# Altium project QCopterFC.PrjPCB
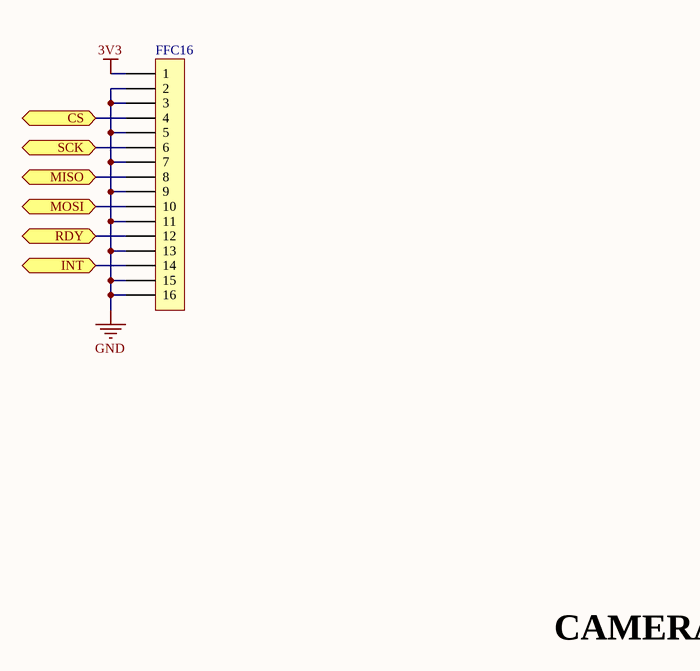
[diagram p0: QCopterFC_CAM_Sch.SchDoc]
6 sheets, 35 parts. Net scope: hierarchical (ports join the sheet entries above them; power ports are global).
Board file: QCopterFC__Pcb.PcbDoc
Sheets:
  QCopterFC_CAM_Sch.SchDoc
  QCopterFC_IMU_Sch.SchDoc
  QCopterFC_KEY_Sch.SchDoc
  QCopterFC_LED_Sch.SchDoc
  QCopterFC_MAIN_Sch.SchDoc
  QCopterFC_MCU_Sch.SchDoc

## Sheet QCopterFC_CAM_Sch.SchDoc
size A4

### Parts
FFC16  FFC_0.5_16  [FFC_0.5_16]  (value not drawn)

### Ports
CS, INT, MISO, MOSI, RDY, SCK

### Nets
3V3: FFC16.1
GND: FFC16.2 FFC16.3 FFC16.5 FFC16.7 FFC16.9 FFC16.11 FFC16.13 FFC16.15 FFC16.16
NetFFC16_4: FFC16.4 ; port CS
NetFFC16_6: FFC16.6 ; port SCK
NetFFC16_8: FFC16.8 ; port MISO
NetFFC16_10: FFC16.10 ; port MOSI
NetFFC16_12: FFC16.12 ; port RDY
NetFFC16_14: FFC16.14 ; port INT

### Notes on the sheet
- CAMERA

### Library data of the parts
FFC16 = FFC_0.5_16: FFC

## Sheet QCopterFC_IMU_Sch.SchDoc
size A4
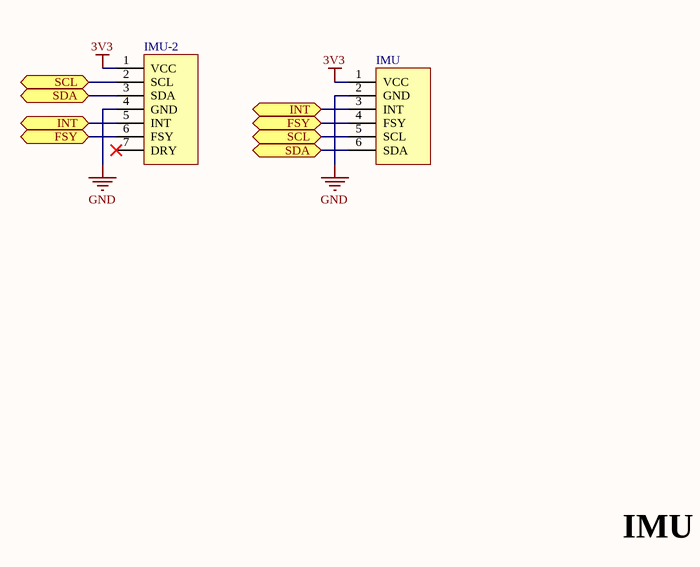
[diagram p1: QCopterFC_IMU_Sch.SchDoc]

### Parts
IMU  IMU  [IMU]
IMU-2  IMU-2  [IMU-2]  (value not drawn)

### Ports
FSY, INT, SCL, SDA

### Nets
3V3: IMU.1(VCC) IMU-2.1(VCC)
GND: IMU.2(GND) IMU-2.4(GND)
NetIMU_3: IMU.3(INT) IMU-2.5(INT) ; port INT
NetIMU_4: IMU.4(FSY) IMU-2.6(FSY) ; port FSY
NetIMU_5: IMU.5(SCL) IMU-2.2(SCL) ; port SCL
NetIMU_6: IMU.6(SDA) IMU-2.3(SDA) ; port SDA

Not connected (* = marked no-connect by the designer): IMU-2 7(DRY)*

### Notes on the sheet
- IMU

### Library data of the parts
IMU = IMU: Module
IMU-2 = IMU-2: Module

## Sheet QCopterFC_KEY_Sch.SchDoc
size A4
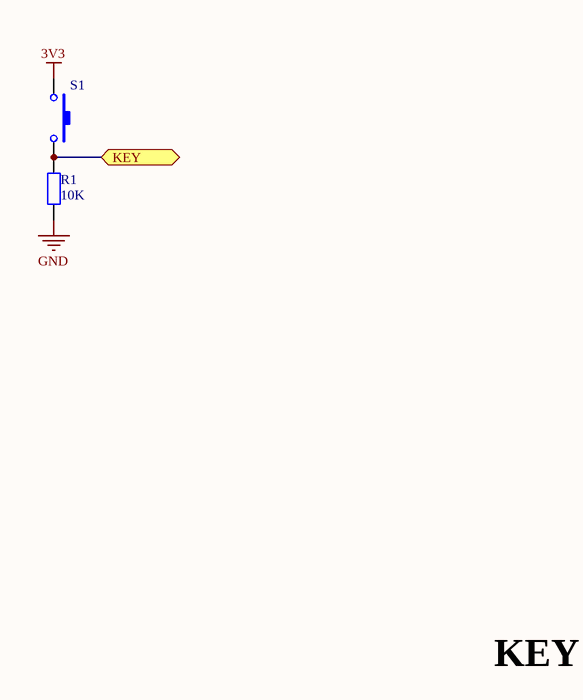
[diagram p2: QCopterFC_KEY_Sch.SchDoc]

### Parts
R1  value 10K  [RES_0603]  (hidden comment: Res_0603)
S1  SW-PB_1  [BT_90_T]  (value not drawn)

### Ports
KEY

### Nets
3V3: S1.1
GND: R1.1
NetR1_2: R1.2 S1.2 ; port KEY

### Notes on the sheet
- KEY

### Library data of the parts
R1 = Res_0603: Resistor
S1 = SW-PB_1: Switch; Published: 24-Mar-1999; LatestRevisionDate: 17-Jul-2002; LatestRevisionNote: Re-released for DXP Platform.; PackageReference: SPST-2; Publisher: Altium Limited; PackageDescription: Switch; 2 Leads

## Sheet QCopterFC_LED_Sch.SchDoc
size A4
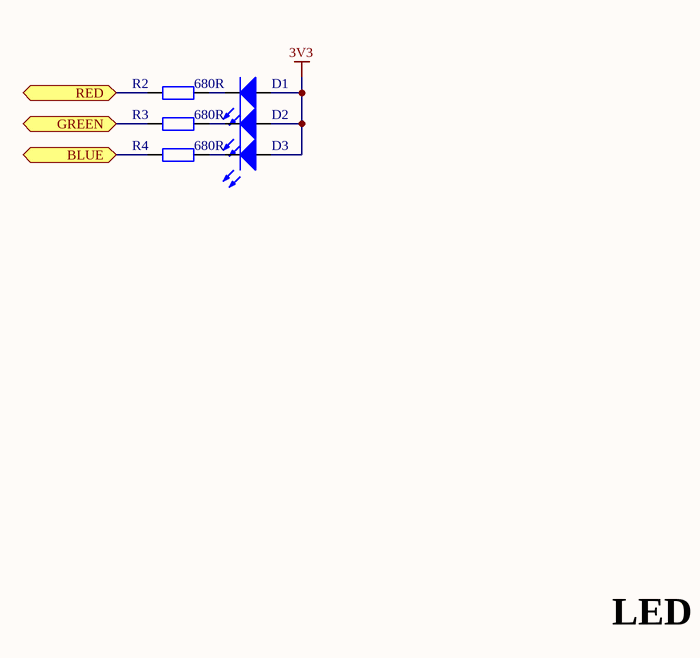
[diagram p3: QCopterFC_LED_Sch.SchDoc]

### Parts
D1  LED_0603_RED  [LED_0603_RED]  (value not drawn)
D2  LED_0603_GREEN  [LED_0603_GREEN]  (value not drawn)
D3  LED_0603_BLUE  [LED_0603_BLUE]  (value not drawn)
R2  value 680R  [RES_0603]  (hidden comment: Res_0603)
R3  value 680R  [RES_0603]  (hidden comment: Res_0603)
R4  value 680R  [RES_0603]  (hidden comment: Res_0603)

### Ports
BLUE, GREEN, RED

### Nets
3V3: D1.1(A) D2.1(A) D3.1(A)
NetD1_2: D1.2(K) R2.2
NetD2_2: D2.2(K) R3.2
NetD3_2: D3.2(K) R4.2
NetR2_1: R2.1 ; port RED
NetR3_1: R3.1 ; port GREEN
NetR4_1: R4.1 ; port BLUE

### Notes on the sheet
- LED

### Library data of the parts
D1 = LED_0603_RED: LED
D2 = LED_0603_GREEN: LED
D3 = LED_0603_BLUE: LED
R2-R4 = Res_0603: Resistor

## Sheet QCopterFC_MAIN_Sch.SchDoc
size A4
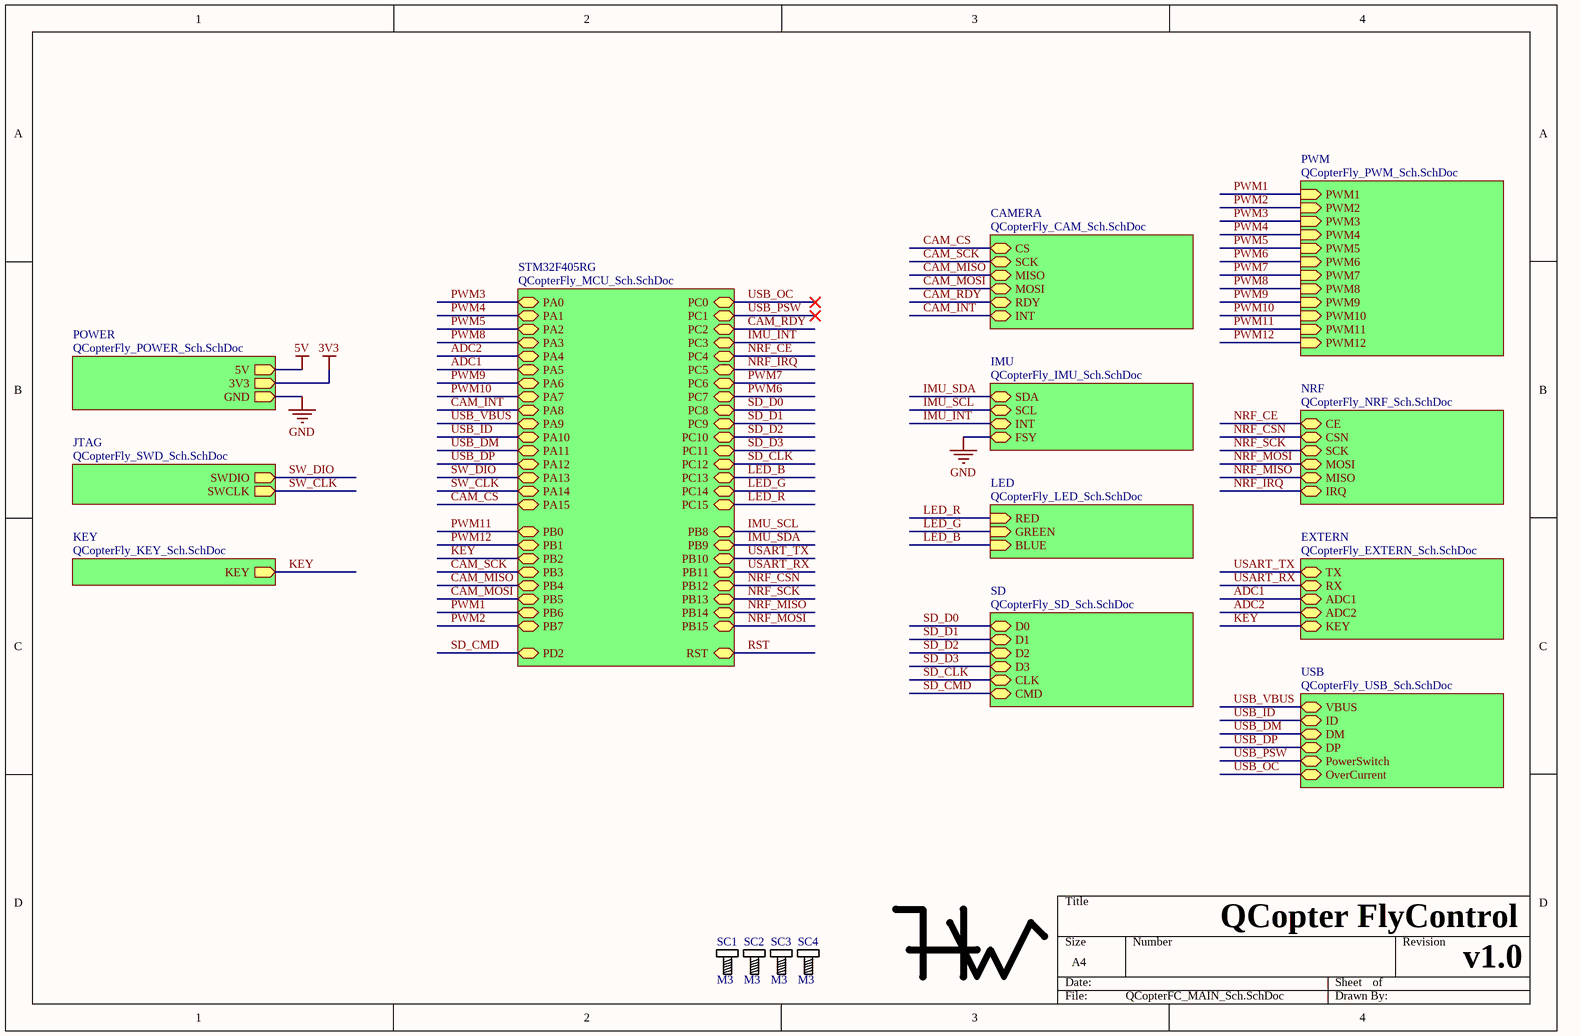
[diagram p4: QCopterFC_MAIN_Sch.SchDoc]

### Parts
Mark1  Mark  [HW_Mark]  (value not drawn)
SC1  M3  [SCRREW_M3]
SC2  M3  [SCRREW_M3]
SC3  M3  [SCRREW_M3]
SC4  M3  [SCRREW_M3]

### Sub-sheets
CAMERA = QCopterFly_CAM_Sch.SchDoc (file not in this document): MISO, CS, MOSI, SCK, RDY, INT
EXTERN = QCopterFly_EXTERN_Sch.SchDoc (file not in this document): ADC1, ADC2, TX, RX, KEY
IMU = QCopterFly_IMU_Sch.SchDoc (file not in this document): SCL, SDA, FSY, INT
JTAG = QCopterFly_SWD_Sch.SchDoc (file not in this document): SWDIO (out), SWCLK (out)
KEY = QCopterFly_KEY_Sch.SchDoc (file not in this document): KEY (out)
LED = QCopterFly_LED_Sch.SchDoc (file not in this document): RED (in), GREEN (in), BLUE (in)
NRF = QCopterFly_NRF_Sch.SchDoc (file not in this document): MISO, MOSI, SCK, CSN, CE, IRQ
POWER = QCopterFly_POWER_Sch.SchDoc (file not in this document): 3V3 (out), 5V (out), GND (out)
PWM = QCopterFly_PWM_Sch.SchDoc (file not in this document): PWM1 (in), PWM2 (in), PWM3 (in), PWM4 (in), PWM5 (in), PWM6 (in), PWM7 (in), PWM8 (in), PWM9 (in), PWM10 (in), PWM11 (in), PWM12 (in)
SD = QCopterFly_SD_Sch.SchDoc (file not in this document): D0, CLK, CMD, D1, D2, D3
STM32F405RG = QCopterFly_MCU_Sch.SchDoc (file not in this document): PA0, PA1, PA2, PA3, PA4, PA5, PA6, PA7, PA8, PA9, PA10, PA11, PA12, PA13, PA14, PA15, PB0, PB1, PB2, PB3, PB4, PB5, PB6, PB7, PB8, PB9, PB10, PB11, PB12, PB13, PB14, PB15, PC0, PC1, PC2, PC3, PC4, PC5, PC6, PC7, PC8, PC9, PC10, PC11, PC12, PC13, PC14, PC15, PD2, RST
USB = QCopterFly_USB_Sch.SchDoc (file not in this document): VBUS, ID, DM, DP, PowerSwitch, OverCurrent

### Nets
5V: sheet POWER/5V
GND: sheet IMU/FSY, sheet POWER/GND
ADC1: sheet STM32F405RG/PA5, sheet EXTERN/ADC1
ADC2: sheet STM32F405RG/PA4, sheet EXTERN/ADC2
CAM_CS: sheet CAMERA/CS, sheet STM32F405RG/PA15
CAM_INT: sheet CAMERA/INT, sheet STM32F405RG/PA8
CAM_MISO: sheet CAMERA/MISO, sheet STM32F405RG/PB4
CAM_MOSI: sheet CAMERA/MOSI, sheet STM32F405RG/PB5
CAM_RDY: sheet CAMERA/RDY, sheet STM32F405RG/PC2
CAM_SCK: sheet CAMERA/SCK, sheet STM32F405RG/PB3
IMU_INT: sheet IMU/INT, sheet STM32F405RG/PC3
IMU_SCL: sheet IMU/SCL, sheet STM32F405RG/PB8
IMU_SDA: sheet IMU/SDA, sheet STM32F405RG/PB9
KEY: sheet KEY/KEY, sheet STM32F405RG/PB2, sheet EXTERN/KEY
LED_B: sheet LED/BLUE, sheet STM32F405RG/PC13
LED_G: sheet LED/GREEN, sheet STM32F405RG/PC14
LED_R: sheet LED/RED, sheet STM32F405RG/PC15
NRF_CE: sheet NRF/CE, sheet STM32F405RG/PC4
NRF_CSN: sheet NRF/CSN, sheet STM32F405RG/PB12
NRF_IRQ: sheet NRF/IRQ, sheet STM32F405RG/PC5
NRF_MISO: sheet NRF/MISO, sheet STM32F405RG/PB14
NRF_MOSI: sheet NRF/MOSI, sheet STM32F405RG/PB15
NRF_SCK: sheet NRF/SCK, sheet STM32F405RG/PB13
PWM1: sheet PWM/PWM1, sheet STM32F405RG/PB6
PWM2: sheet PWM/PWM2, sheet STM32F405RG/PB7
PWM3: sheet PWM/PWM3, sheet STM32F405RG/PA0
PWM4: sheet PWM/PWM4, sheet STM32F405RG/PA1
PWM5: sheet PWM/PWM5, sheet STM32F405RG/PA2
PWM6: sheet PWM/PWM6, sheet STM32F405RG/PC7
PWM7: sheet PWM/PWM7, sheet STM32F405RG/PC6
PWM8: sheet PWM/PWM8, sheet STM32F405RG/PA3
PWM9: sheet PWM/PWM9, sheet STM32F405RG/PA6
PWM10: sheet PWM/PWM10, sheet STM32F405RG/PA7
PWM11: sheet PWM/PWM11, sheet STM32F405RG/PB0
PWM12: sheet PWM/PWM12, sheet STM32F405RG/PB1
RST: sheet STM32F405RG/RST
SD_CLK: sheet STM32F405RG/PC12, sheet SD/CLK
SD_CMD: sheet STM32F405RG/PD2, sheet SD/CMD
SD_D0: sheet STM32F405RG/PC8, sheet SD/D0
SD_D1: sheet STM32F405RG/PC9, sheet SD/D1
SD_D2: sheet STM32F405RG/PC10, sheet SD/D2
SD_D3: sheet STM32F405RG/PC11, sheet SD/D3
SW_CLK: sheet JTAG/SWCLK, sheet STM32F405RG/PA14
SW_DIO: sheet JTAG/SWDIO, sheet STM32F405RG/PA13
USART_RX: sheet STM32F405RG/PB11, sheet EXTERN/RX
USART_TX: sheet STM32F405RG/PB10, sheet EXTERN/TX
USB_DM: sheet STM32F405RG/PA11, sheet USB/DM
USB_DP: sheet STM32F405RG/PA12, sheet USB/DP
USB_ID: sheet STM32F405RG/PA10, sheet USB/ID
USB_OC: sheet STM32F405RG/PC0, sheet USB/OverCurrent
USB_PSW: sheet STM32F405RG/PC1, sheet USB/PowerSwitch
USB_VBUS: sheet STM32F405RG/PA9, sheet USB/VBUS

### Notes on the sheet
- QCopter FlyControl
- v1.0

### Library data of the parts
Mark1 = HW
SC1-SC4 = Screw_M3: Screw

## Sheet QCopterFC_MCU_Sch.SchDoc
size A4
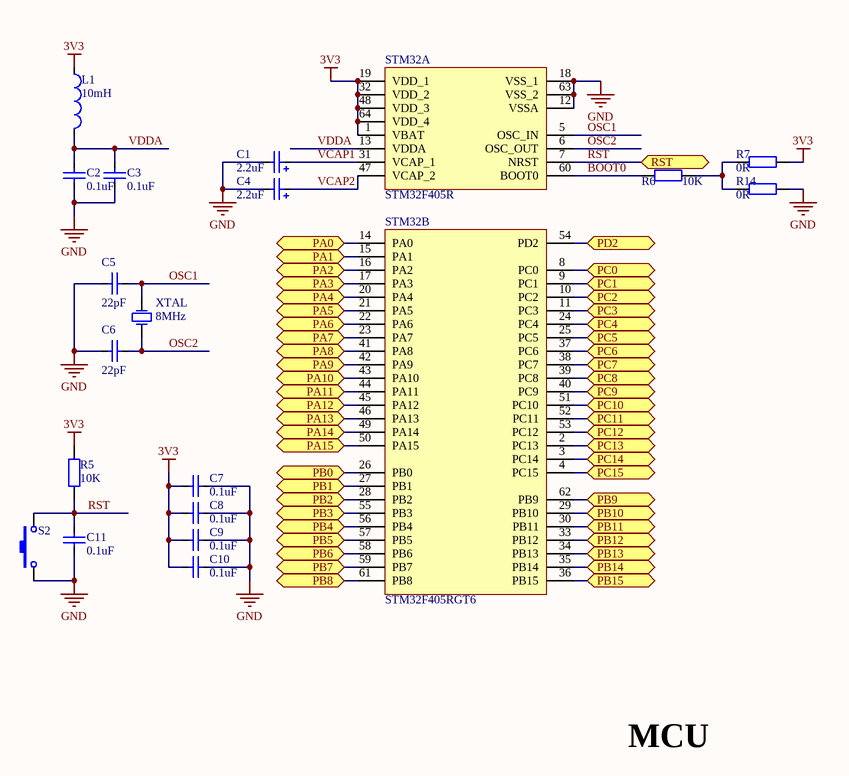
[diagram p5: QCopterFC_MCU_Sch.SchDoc]

### Parts
C1  value 2.2uF  [CAP_TAN_P0805]  (hidden comment: Cap_Tan_0805)
C2  value 0.1uF  [CAP_0603]  (hidden comment: Cap_0603)
C3  value 0.1uF  [CAP_0603]  (hidden comment: Cap_0603)
C4  value 2.2uF  [CAP_TAN_P0805]  (hidden comment: Cap_Tan_0805)
C5  value 22pF  [CAP_0603]  (hidden comment: Cap_0603)
C6  value 22pF  [CAP_0603]  (hidden comment: Cap_0603)
C7  value 0.1uF  [CAP_0603]  (hidden comment: Cap_0603)
C8  value 0.1uF  [CAP_0603]  (hidden comment: Cap_0603)
C9  value 0.1uF  [CAP_0603]  (hidden comment: Cap_0603)
C10  value 0.1uF  [CAP_0603]  (hidden comment: Cap_0603)
C11  value 0.1uF  [CAP_0603]  (hidden comment: Cap_0603)
L1  value 10mH  [IND_0603]  (hidden comment: Ind_0603)
R5  value 10K  [RES_0603]  (hidden comment: Res_0603)
R6  value 10K  [RES_0603]  (hidden comment: Res_0603)
R7  value 0R  [RES_0603]  (hidden comment: Res_0603)
R14  value 0R  [RES_0603]  (hidden comment: Res_0603)
S2  SW-PB_1  [BT_90_T]  (value not drawn)
STM32  STM32F405R  [STM32F_64]  (parts A,B of 2)
XTAL  value 8MHz  [XTAL_5032]  (hidden comment: XTAL_5032)

### Ports
PA0, PA1, PA2, PA3, PA4, PA5, PA6, PA7, PA8, PA9, PA10, PA11, PA12, PA13, PA14, PA15, PB0, PB1, PB2, PB3, PB4, PB5, PB6, PB7, PB8, PB9, PB10, PB11, PB12, PB13, PB14, PB15, PC0, PC1, PC2, PC3, PC4, PC5, PC6, PC7, PC8, PC9, PC10, PC11, PC12, PC13, PC14, PC15, PD2, RST

### Nets
3V3: C7.2 C8.2 C9.2 C10.2 L1.1 R5.1 R7.2 STM32.1(VBAT) STM32.19(VDD_1) STM32.32(VDD_2) STM32.48(VDD_3) STM32.64(VDD_4)
GND: C1.2 C2.2 C3.2 C4.2 C5.1 C6.1 C7.1 C8.1 C9.1 C10.1 C11.2 R14.2 S2.1 STM32.12(VSSA) STM32.18(VSS_1) STM32.63(VSS_2)
BOOT0: R6.1 STM32.60(BOOT0)
OSC1: C5.2 STM32.5(OSC_IN) XTAL.2(OSC2)
OSC2: C6.2 STM32.6(OSC_OUT) XTAL.1(OSC1)
RST: C11.1 R5.2 S2.2 STM32.7(NRST) ; port RST
VCAP1: C1.1 STM32.31(VCAP_1)
VCAP2: C4.1 STM32.47(VCAP_2)
VDDA: C2.1 C3.1 L1.2 STM32.13(VDDA)
NetR6_2: R6.2 R7.1 R14.1
NetSTM32_2: STM32.2(PC13) ; port PC13
NetSTM32_3: STM32.3(PC14) ; port PC14
NetSTM32_4: STM32.4(PC15) ; port PC15
NetSTM32_8: STM32.8(PC0) ; port PC0
NetSTM32_9: STM32.9(PC1) ; port PC1
NetSTM32_10: STM32.10(PC2) ; port PC2
NetSTM32_11: STM32.11(PC3) ; port PC3
NetSTM32_14: STM32.14(PA0) ; port PA0
NetSTM32_15: STM32.15(PA1) ; port PA1
NetSTM32_16: STM32.16(PA2) ; port PA2
NetSTM32_17: STM32.17(PA3) ; port PA3
NetSTM32_20: STM32.20(PA4) ; port PA4
NetSTM32_21: STM32.21(PA5) ; port PA5
NetSTM32_22: STM32.22(PA6) ; port PA6
NetSTM32_23: STM32.23(PA7) ; port PA7
NetSTM32_24: STM32.24(PC4) ; port PC4
NetSTM32_25: STM32.25(PC5) ; port PC5
NetSTM32_26: STM32.26(PB0) ; port PB0
NetSTM32_27: STM32.27(PB1) ; port PB1
NetSTM32_28: STM32.28(PB2) ; port PB2
NetSTM32_29: STM32.29(PB10) ; port PB10
NetSTM32_30: STM32.30(PB11) ; port PB11
NetSTM32_33: STM32.33(PB12) ; port PB12
NetSTM32_34: STM32.34(PB13) ; port PB13
NetSTM32_35: STM32.35(PB14) ; port PB14
NetSTM32_36: STM32.36(PB15) ; port PB15
NetSTM32_37: STM32.37(PC6) ; port PC6
NetSTM32_38: STM32.38(PC7) ; port PC7
NetSTM32_39: STM32.39(PC8) ; port PC8
NetSTM32_40: STM32.40(PC9) ; port PC9
NetSTM32_41: STM32.41(PA8) ; port PA8
NetSTM32_42: STM32.42(PA9) ; port PA9
NetSTM32_43: STM32.43(PA10) ; port PA10
NetSTM32_44: STM32.44(PA11) ; port PA11
NetSTM32_45: STM32.45(PA12) ; port PA12
NetSTM32_46: STM32.46(PA13) ; port PA13
NetSTM32_49: STM32.49(PA14) ; port PA14
NetSTM32_50: STM32.50(PA15) ; port PA15
NetSTM32_51: STM32.51(PC10) ; port PC10
NetSTM32_52: STM32.52(PC11) ; port PC11
NetSTM32_53: STM32.53(PC12) ; port PC12
NetSTM32_54: STM32.54(PD2) ; port PD2
NetSTM32_55: STM32.55(PB3) ; port PB3
NetSTM32_56: STM32.56(PB4) ; port PB4
NetSTM32_57: STM32.57(PB5) ; port PB5
NetSTM32_58: STM32.58(PB6) ; port PB6
NetSTM32_59: STM32.59(PB7) ; port PB7
NetSTM32_61: STM32.61(PB8) ; port PB8
NetSTM32_62: STM32.62(PB9) ; port PB9

### Notes on the sheet
- MCU

### Library data of the parts
C1 C4 = Cap_Tan_0805: Capacitor
C2 C3 C5-C11 = Cap_0603: Capacitor
L1 = Ind_0603: Inductor
R5-R7 R14 = Res_0603: Resistor
S2 = SW-PB_1: Switch; Published: 24-Mar-1999; LatestRevisionDate: 17-Jul-2002; LatestRevisionNote: Re-released for DXP Platform.; PackageReference: SPST-2; Publisher: Altium Limited; PackageDescription: Switch; 2 Leads
STM32 = STM32F405R: MCU
XTAL = XTAL_5032: Crystal Oscillator; Published: 8-Jun-2000; LatestRevisionDate: 17-Jul-2002; LatestRevisionNote: Re-released for DXP Platform.; PackageReference: R38; Publisher: Altium Limited; PackageDescription: Crystal, Thru-Hole; 2 Leads; Body 3.1 x 8.2 mm (Dia.xH)

## Nets that join several sheets
3V3: QCopterFC_CAM_Sch (FFC16.1), QCopterFC_IMU_Sch (IMU.1 IMU-2.1), QCopterFC_KEY_Sch (S1.1), QCopterFC_LED_Sch (D1.1 D2.1 D3.1), QCopterFC_MCU_Sch (12 pins)
GND: QCopterFC_CAM_Sch (9 pins), QCopterFC_IMU_Sch (IMU.2 IMU-2.4), QCopterFC_KEY_Sch (R1.1), QCopterFC_MCU_Sch (16 pins)